# Altium schematic sheet V_18.SchDoc
size A4
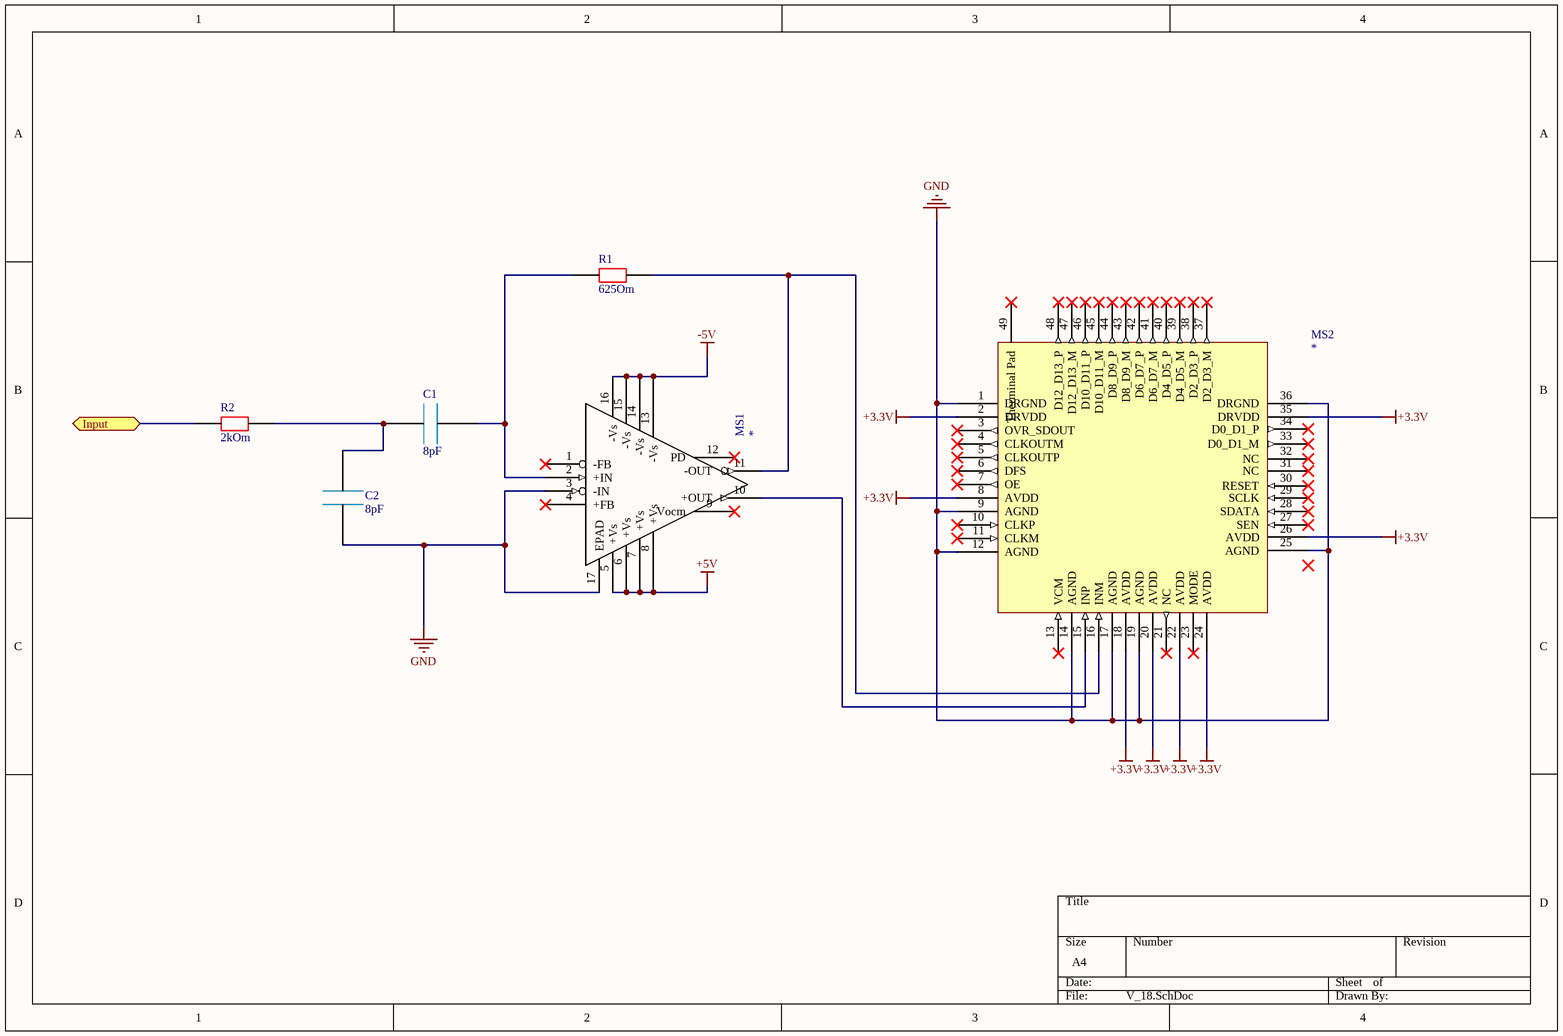
[diagram p0: V_18.SchDoc]

## Parts
C1  8pF  [Ñ1]
C2  8pF  [Ñ1]
MS1  *  [ADA4932]
MS2  *  [ADS61B49]
R1  625Om  [Res0805]
R2  2kOm  [Res0805]

## Ports
Input

## Nets
+3.3V: MS2.2(DRVDD) MS2.8(AVDD) MS2.18(AVDD) MS2.20(AVDD) MS2.22(AVDD) MS2.24(AVDD) MS2.26(AVDD) MS2.35(DRVDD)
+5V: MS1.5(+Vs) MS1.6(+Vs) MS1.7(+Vs) MS1.8(+Vs)
-5V: MS1.13(-Vs) MS1.14(-Vs) MS1.15(-Vs) MS1.16(-Vs)
GND: C2.54 MS1.3(-IN) MS1.17(EPAD) MS2.1(DRGND) MS2.9(AGND) MS2.12(AGND) MS2.14(AGND) MS2.17(AGND) MS2.19(AGND) MS2.25(AGND) MS2.36(DRGND)
Input: R2.1 ; port Input
NetC1_53: C1.53 C2.53 R2.2
NetC1_54: C1.54 MS1.2(+IN) R1.1
NetMS1_10: MS1.10(+OUT) MS2.15(INP)
NetMS1_11: MS1.11(-OUT) MS2.16(INM) R1.2

Not connected (* = marked no-connect by the designer): MS1 1(-FB)* 4(+FB)* 9(Vocm)* 12(PD)*; MS2 3(OVR_SDOUT)* 4(CLKOUTM)* 5(CLKOUTP)* 6(DFS)* 7(OE)* 10(CLKP)* 11(CLKM)* 13(VCM)* 21(NC)* 23(MODE)* 27(SEN)* 28(SDATA)* 29(SCLK)* 30(RESET)* 31(NC)* 32(NC)* 33(D0_D1_M)* 34(D0_D1_P)* 37(D2_D3_M)* 38(D2_D3_P)* 39(D4_D5_M)* 40(D4_D5_P)* 41(D6_D7_M)* 42(D6_D7_P)* 43(D8_D9_M)* 44(D8_D9_P)* 45(D10_D11_M)* 46(D10_D11_P)* 47(D12_D13_M)* 48(D12_D13_P)* 49(Therminal_Pad)*

## Library data of the parts
C1 C2 = Ñ1
MS1 = ADA4932: Value: *
MS2 = ADS61B49: Value: *
R1 R2 = Res: Value: *